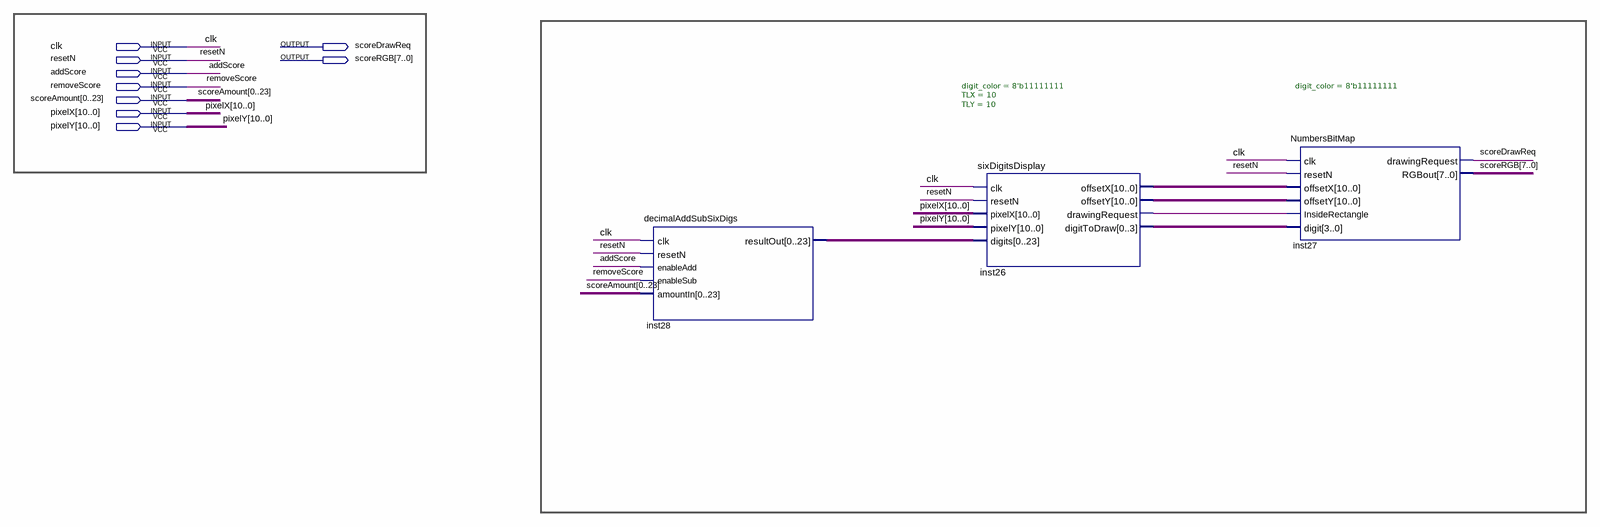
[diagram p0: schematic sheet]
// Quartus schematic TOP_SCORE.bdf as structural Verilog: 3 symbols, 9 pins
module TOP_SCORE (
  input  clk,
  input  resetN,
  input  addScore,
  input  removeScore,
  input  [0:23] scoreAmount,
  input  [10:0] pixelX,
  input  [10:0] pixelY,
  output scoreDrawReq,
  output [7:0] scoreRGB
);

  wire inst26_drawingrequest;
  wire [3:0] inst26_digittodraw;
  wire [10:0] inst26_offsetx, inst26_offsety;
  wire [23:0] inst28_resultout;

  decimalAddSubSixDigs inst28 (
    .clk(clk), .resetN(resetN), .enableAdd(addScore), .enableSub(removeScore), .amountIn(scoreAmount),
    .resultOut(inst28_resultout));
  sixDigitsDisplay #(.digit_color(8'b11111111), .TLX(10), .TLY(10)) inst26 (
    .clk(clk), .resetN(resetN), .pixelX(pixelX), .pixelY(pixelY), .digits(inst28_resultout),
    .offsetX(inst26_offsetx), .offsetY(inst26_offsety), .drawingRequest(inst26_drawingrequest),
    .digitToDraw(inst26_digittodraw));
  NumbersBitMap #(.digit_color(8'b11111111)) inst27 (
    .clk(clk), .resetN(resetN), .offsetX(inst26_offsetx), .offsetY(inst26_offsety),
    .InsideRectangle(inst26_drawingrequest), .digit(inst26_digittodraw), .drawingRequest(scoreDrawReq),
    .RGBout(scoreRGB));
endmodule
